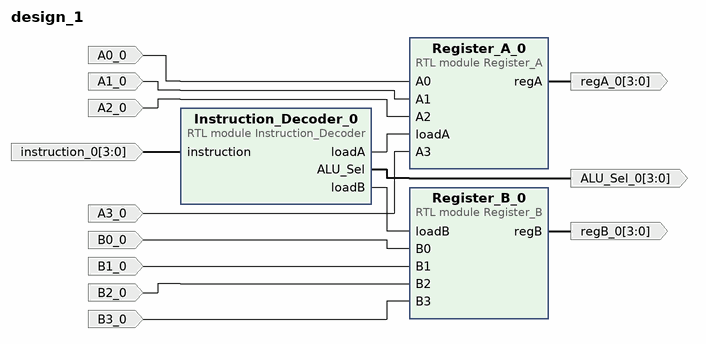
[diagram p0: block diagram of the top level]
# Vivado block design design_1, xc7a100tcsg324-1, Vivado 2019.2
create_bd_design design_1

create_bd_port -dir O -from 3 -to 0 ALU_Sel_0
create_bd_port -dir I -from 3 -to 0 instruction_0
create_bd_port -dir I A0_0
create_bd_port -dir I A1_0
create_bd_port -dir I A2_0
create_bd_port -dir I A3_0
create_bd_port -dir O -from 3 -to 0 regA_0
create_bd_port -dir O -from 3 -to 0 regB_0
create_bd_port -dir I B0_0
create_bd_port -dir I B1_0
create_bd_port -dir I B2_0
create_bd_port -dir I B3_0

create_bd_cell -type module -reference Register_A Register_A_0
create_bd_cell -type module -reference Register_B Register_B_0
create_bd_cell -type module -reference Instruction_Decoder Instruction_Decoder_0

# ---- connections ----

connect_bd_net [get_bd_pins Instruction_Decoder_0/loadA] [get_bd_pins Register_A_0/loadA]
connect_bd_net [get_bd_pins Instruction_Decoder_0/loadB] [get_bd_pins Register_B_0/loadB]
connect_bd_net [get_bd_pins Instruction_Decoder_0/ALU_Sel] [get_bd_ports ALU_Sel_0]
connect_bd_net -net instruction_0_1 [get_bd_ports instruction_0] [get_bd_pins Instruction_Decoder_0/instruction]
connect_bd_net -net A0_0_1 [get_bd_ports A0_0] [get_bd_pins Register_A_0/A0]
connect_bd_net -net A1_0_1 [get_bd_ports A1_0] [get_bd_pins Register_A_0/A1]
connect_bd_net -net A2_0_1 [get_bd_ports A2_0] [get_bd_pins Register_A_0/A2]
connect_bd_net -net A3_0_1 [get_bd_ports A3_0] [get_bd_pins Register_A_0/A3]
connect_bd_net [get_bd_pins Register_A_0/regA] [get_bd_ports regA_0]
connect_bd_net [get_bd_pins Register_B_0/regB] [get_bd_ports regB_0]
connect_bd_net -net B0_0_1 [get_bd_ports B0_0] [get_bd_pins Register_B_0/B0]
connect_bd_net -net B1_0_1 [get_bd_ports B1_0] [get_bd_pins Register_B_0/B1]
connect_bd_net -net B2_0_1 [get_bd_ports B2_0] [get_bd_pins Register_B_0/B2]
connect_bd_net -net B3_0_1 [get_bd_ports B3_0] [get_bd_pins Register_B_0/B3]

validate_bd_design
save_bd_design
